# EAGLE design tablespoon (EAGLE 6.5.0)
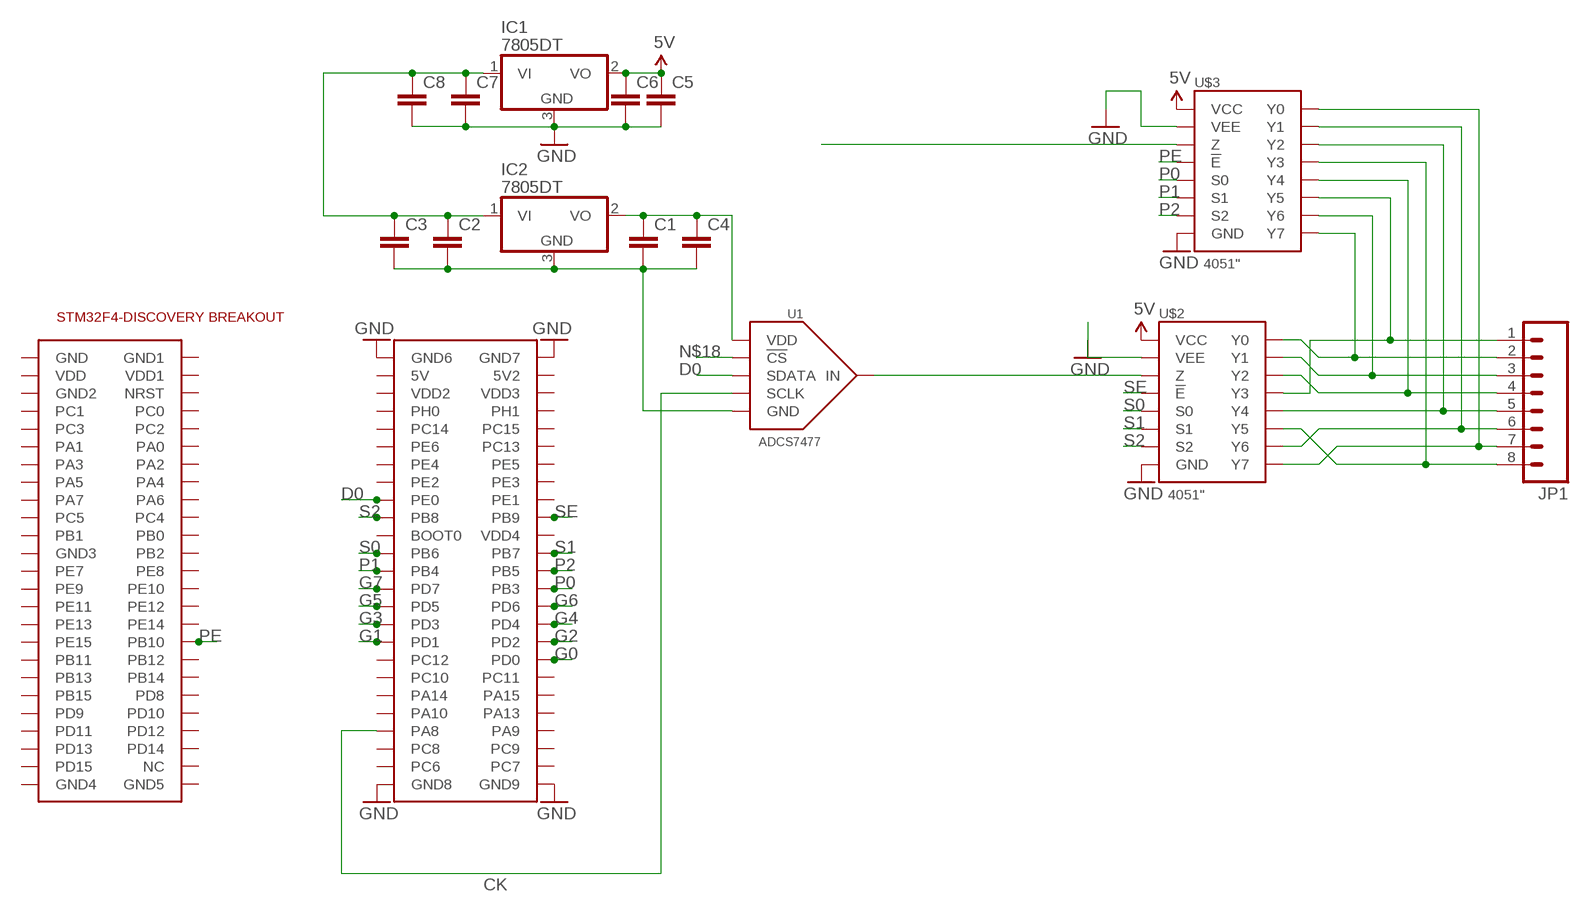
[diagram p0: schematic, sheet 1]

## Parts
C1  C-EUC0805  [C0805]
C2  C-EUC0805  [C0805]
C3  C-EUC0805  [C0805]
C4  C-EUC0805  [C0805]
C5  C-EUC0805  [C0805]
C6  C-EUC0805  [C0805]
C7  C-EUC0805  [C0805]
C8  C-EUC0805  [C0805]
IC1  7805DT  [TO252]
IC2  7805DT  [TO252]
JP1  M08LONGPADS  [1X08_LONGPADS]
U1  ADCS7477  [SOT-23-6]
U$1  STM32F4-DISCOVERY  [STM32F4-DISCOVERY]
U$2  4051"  [TSSOP-16]
U$3  4051"  [TSSOP-16]

## Nets
5V: C5.1 C6.1 IC1.2(VO) U$2.P$16(VCC) U$3.P$16(VCC)
CK: U1.P$4(SCLK) U$1.P$93(PA8)
D0: U1.P$5(SDATA) U$1.P$67(PE0)
G0: U$1.P$86(PD0)
G1: U$1.P$83(PD1)
G2: U$1.P$84(PD2)
G3: U$1.P$81(PD3)
G4: U$1.P$82(PD4)
G5: U$1.P$79(PD5)
G6: U$1.P$80(PD6)
G7: U$1.P$77(PD7)
GND: C5.2 C6.2 C7.2 C8.2 IC1.3(GND) U$1.P$51(GND6) U$1.P$52(GND7) U$1.P$99(GND8) U$1.P$100(GND9) U$2.P$7(VEE) U$2.P$8(GND) U$3.P$7(VEE) U$3.P$8(GND)
N$1: U1.P$3(IN) U$2.P$3(Z)
N$2: C1.1 C4.1 IC2.2(VO) U1.P$1(VDD)
N$3: C1.2 C2.2 C3.2 C4.2 IC2.3(GND) U1.P$2(GND)
N$5: C2.1 C3.1 C7.1 C8.1 IC1.1(VI) IC2.1(VI)
N$6: JP1.4 U$2.P$15(Y2) U$3.P$1(Y4)
N$7: JP1.7 U$2.P$4(Y7) U$3.P$13(Y0)
N$8: JP1.5 U$2.P$1(Y4) U$3.P$15(Y2)
N$9: JP1.8 U$2.P$5(Y5) U$3.P$12(Y3)
N$10: JP1.1 U$2.P$12(Y3) U$3.P$5(Y5)
N$11: JP1.2 U$2.P$13(Y0) U$3.P$4(Y7)
N$12: JP1.3 U$2.P$14(Y1) U$3.P$2(Y6)
N$13: JP1.6 U$2.P$2(Y6) U$3.P$14(Y1)
N$18: U1.P$6(!CS)
N$27: U$3.P$3(Z)
P0: U$1.P$78(PB3) U$3.P$11(S0)
P1: U$1.P$75(PB4) U$3.P$10(S1)
P2: U$1.P$76(PB5) U$3.P$9(S2)
PE: U$1.P$34(PB10) U$3.P$6(!E)
S0: U$1.P$73(PB6) U$2.P$11(S0)
S1: U$1.P$74(PB7) U$2.P$10(S1)
S2: U$1.P$69(PB8) U$2.P$9(S2)
SE: U$1.P$70(PB9) U$2.P$6(!E)
Unconnected: U$1.P$1(GND) U$1.P$2(GND1) U$1.P$3(VDD) U$1.P$4(VDD1) U$1.P$5(GND2) U$1.P$6(NRST) U$1.P$7(PC1) U$1.P$8(PC0) U$1.P$9(PC3) U$1.P$10(PC2) U$1.P$11(PA1) U$1.P$12(PA0) U$1.P$13(PA3) U$1.P$14(PA2) U$1.P$15(PA5) U$1.P$16(PA4) U$1.P$17(PA7) U$1.P$18(PA6) U$1.P$19(PC5) U$1.P$20(PC4) U$1.P$21(PB1) U$1.P$22(PB0) U$1.P$23(GND3) U$1.P$24(PB2) U$1.P$25(PE7) U$1.P$26(PE8) U$1.P$27(PE9) U$1.P$28(PE10) U$1.P$29(PE11) U$1.P$30(PE12) U$1.P$31(PE13) U$1.P$32(PE14) U$1.P$33(PE15) U$1.P$35(PB11) U$1.P$36(PB12) U$1.P$37(PB13) U$1.P$38(PB14) U$1.P$39(PB15) U$1.P$40(PD8) U$1.P$41(PD9) U$1.P$42(PD10) U$1.P$43(PD11) U$1.P$44(PD12) U$1.P$45(PD13) U$1.P$46(PD14) U$1.P$47(PD15) U$1.P$48(NC) U$1.P$49(GND4) U$1.P$50(GND5) U$1.P$53(5V) U$1.P$54(5V2) U$1.P$55(VDD2) U$1.P$56(VDD3) U$1.P$57(PH0) U$1.P$58(PH1) U$1.P$59(PC14) U$1.P$60(PC15) U$1.P$61(PE6) U$1.P$62(PC13) U$1.P$63(PE4) U$1.P$64(PE5) U$1.P$65(PE2) U$1.P$66(PE3) U$1.P$68(PE1) U$1.P$71(BOOT0) U$1.P$72(VDD4) U$1.P$85(PC12) U$1.P$87(PC10) U$1.P$88(PC11) U$1.P$89(PA14) U$1.P$90(PA15) U$1.P$91(PA10) U$1.P$92(PA13) U$1.P$94(PA9) U$1.P$95(PC8) U$1.P$96(PC9) U$1.P$97(PC6) U$1.P$98(PC7)

## Library data of the parts
C1-C8 = rcl:C-EU: CAPACITOR, European symbol
IC1 IC2 = linear:78*: Positive VOLTAGE REGULATOR Source: http://cache.national.com/ds/LM/LM78L05.pdf http://www.fairchildsemi.com/ds/LM/LM7805.pdf
JP1 = SparkFun-Connectors:M08: Header 8 Standard 8-pin 0.1" header. Use with straight break away headers (SKU : PRT-00116), right angle break away headers (PRT-00553), swiss pins (PRT-00743), machine pins (PRT-00117), and female headers (PRT-00115).
U1 = butter:ADCS7477: TI ADCS7477 10 bit 1MSPS ADC 5V 10mW Digikey <http://www.digikey.com/product-detail/en/ADCS7477AIMF%2FNOPB/ADCS7477AIMF%2FNOPBTR-ND/568478>
U$1 = STM32F4-DISCOVERY:STM32F4-DISCOVERY
U$2 U$3 = butter:4051: 74HC4051PW NXP 8:1 Analog Multiplexer digikey <http://www.digikey.com/product-detail/en/74HC4051PW,118/568-2259-1-ND/946721>

## Board
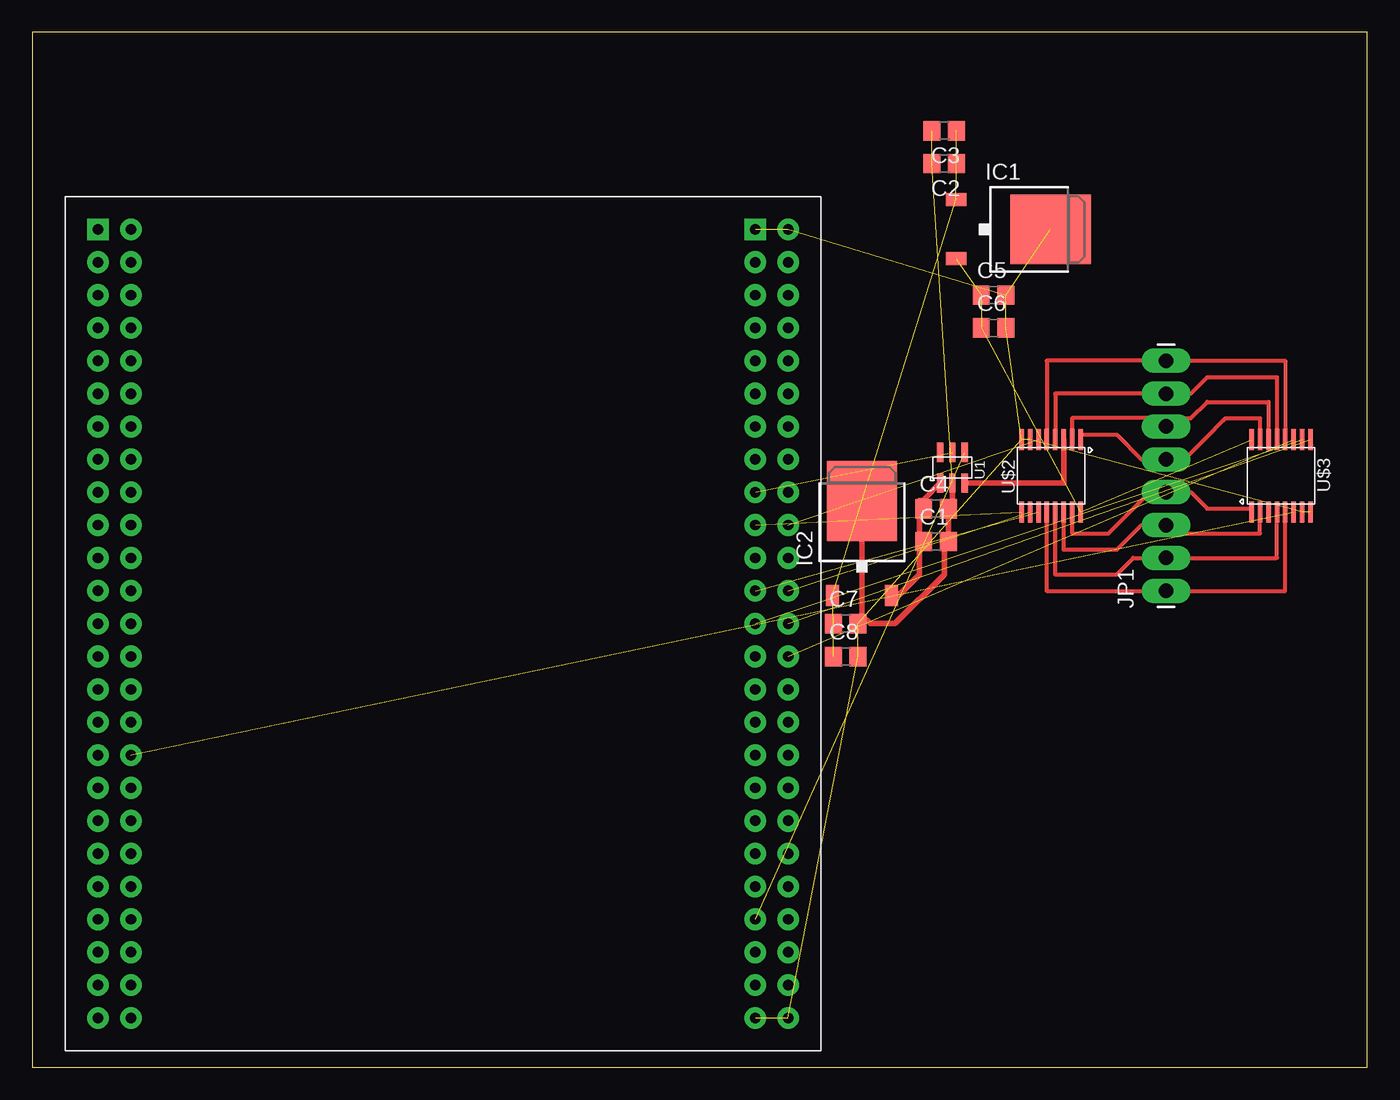
[diagram p1: board, top side]

Size 103.17 x 80 mm. Coordinates in mm from the lower left corner, seen from the top.
Outline: 0,0 103.17,0 103.17,80 0,80 0,0
Copper layers (1*16): Top 0.035mm / dielectric 1.5mm / Bottom 0.035mm
Design rules "default": minimum track width 10mil, minimum drill 24mil, track to track 8mil, track to pad 8mil, pad to pad 8mil, via to via 8mil, smd to smd 8mil, copper to edge 40mil, drill to drill 8mil, minimum pad ring 10mil, minimum via ring 8mil, stop-mask expansion 4mil, vias tented up to drill 0mil, thermal gap 10mil

### Footprints (pad centres in the part's own frame; a part is rotated, then mirrored left to right if it is on the bottom)
C0805 = smd 1.3 x 1.5: 1 -0.95,0; 2 0.95,0
TO252 = smd 1 x 1.6: 1 -2.28,-4.8; 2 2.28,-4.8 | smd 5.4 x 6.2: 3 0,2.5
1X08_LONGPADS = drill 1.118 pad 1.88 long: 1 0,0; 2 2.54,0; 3 5.08,0; 4 7.62,0; 5 10.16,0; 6 12.7,0; 7 15.24,0; 8 17.78,0
SOT-23-6 = smd 1.473 x 0.483: P$1 -1.181,0.95; P$2 -1.181,0; P$3 -1.181,-0.95; P$4 1.181,-0.95; P$5 1.181,0; P$6 1.181,0.95
STM32F4-DISCOVERY = drill 0.8 pad 1.676 square: P$1 -27.94,30.48; P$51 22.86,30.48 | drill 0.8 pad 1.676: P$2 -25.4,30.48; P$3 -27.94,27.94; P$4 -25.4,27.94; P$5 -27.94,25.4; P$6 -25.4,25.4; P$7 -27.94,22.86; P$8 -25.4,22.86; P$9 -27.94,20.32; P$10 -25.4,20.32; P$11 -27.94,17.78; P$12 -25.4,17.78; P$13 -27.94,15.24; P$14 -25.4,15.24; P$15 -27.94,12.7; P$16 -25.4,12.7; P$17 -27.94,10.16; P$18 -25.4,10.16; P$19 -27.94,7.62; P$20 -25.4,7.62; P$21 -27.94,5.08; P$22 -25.4,5.08; P$23 -27.94,2.54; P$24 -25.4,2.54; P$25 -27.94,0; P$26 -25.4,0; P$27 -27.94,-2.54; P$28 -25.4,-2.54; P$29 -27.94,-5.08; P$30 -25.4,-5.08; P$31 -27.94,-7.62; P$32 -25.4,-7.62; P$33 -27.94,-10.16; P$34 -25.4,-10.16; P$35 -27.94,-12.7; P$36 -25.4,-12.7; P$37 -27.94,-15.24; P$38 -25.4,-15.24; P$39 -27.94,-17.78; P$40 -25.4,-17.78; P$41 -27.94,-20.32; P$42 -25.4,-20.32; P$43 -27.94,-22.86; P$44 -25.4,-22.86; P$45 -27.94,-25.4; P$46 -25.4,-25.4; P$47 -27.94,-27.94; P$48 -25.4,-27.94; P$49 -27.94,-30.48; P$50 -25.4,-30.48; P$52 25.4,30.48; P$53 22.86,27.94; P$54 25.4,27.94; P$55 22.86,25.4; P$56 25.4,25.4; P$57 22.86,22.86; P$58 25.4,22.86; P$59 22.86,20.32; P$60 25.4,20.32; P$61 22.86,17.78; P$62 25.4,17.78; P$63 22.86,15.24; P$64 25.4,15.24; P$65 22.86,12.7; P$66 25.4,12.7; P$67 22.86,10.16; P$68 25.4,10.16; P$69 22.86,7.62; P$70 25.4,7.62; P$71 22.86,5.08; P$72 25.4,5.08; P$73 22.86,2.54; P$74 25.4,2.54; P$75 22.86,0; P$76 25.4,0; P$77 22.86,-2.54; P$78 25.4,-2.54; P$79 22.86,-5.08; P$80 25.4,-5.08; P$81 22.86,-7.62; P$82 25.4,-7.62; P$83 22.86,-10.16; P$84 25.4,-10.16; P$85 22.86,-12.7; P$86 25.4,-12.7; P$87 22.86,-15.24; P$88 25.4,-15.24; P$89 22.86,-17.78; P$90 25.4,-17.78; P$91 22.86,-20.32; P$92 25.4,-20.32; P$93 22.86,-22.86; P$94 25.4,-22.86; P$95 22.86,-25.4; P$96 25.4,-25.4; P$97 22.86,-27.94; P$98 25.4,-27.94; P$99 22.86,-30.48; P$100 25.4,-30.48
TSSOP-16 = smd 1.6 x 0.35: P$1 -2.8,2.275; P$2 -2.8,1.625; P$3 -2.8,0.975; P$4 -2.8,0.325; P$5 -2.8,-0.325; P$6 -2.8,-0.975; P$7 -2.8,-1.625; P$8 -2.8,-2.275; P$9 2.8,-2.275; P$10 2.8,-1.625; P$11 2.8,-0.975; P$12 2.8,-0.325; P$13 2.8,0.325; P$14 2.8,0.975; P$15 2.8,1.625; P$16 2.8,2.275

### Placement (x,y rotation side)
C1  69.85,40.64 0 top
C2  70.48,69.85 180 top
C3  70.48,72.39 180 top
C4  69.85,43.18 0 top
C5  74.3,59.69 0 top
C6  74.3,57.15 0 top
C7  62.87,34.29 0 top
C8  62.87,31.75 0 top
IC1  76.2,64.77 270 top
IC2  64.14,41.27 0 top
JP1  87.63,36.83 90 top
U1  71.12,46.35 90 top
U$1  33.02,34.29 0 top
U$2  78.74,45.72 270 top
U$3  96.52,45.72 90 top

### Tracks (layer width: path | path; a pad name or v marks a point on that pad's centre or on a via)
5V  (4 unrouted)
CK  (1 unrouted)
D0  (1 unrouted)
GND  (12 unrouted)
N$1
  Top 0.406: U1.P$3 79.72,45.17 U$2.P$3
N$2
  Top 0.406: U1.P$1 68.9,43.9 C4.1 68.9,43.81 68.58,43.81 68.58,40.64 C1.1 68.58,40.32 68.58,38.1 66.95,36.48 IC2.2
N$3  (2 unrouted)
  Top 0.406: U1.P$2 71.12,43.18 C4.2 C1.2 70.48,40.33 70.48,38.1 66.67,34.29 64.77,34.29 64.14,34.92 IC2.3
N$5  (5 unrouted)
N$6
  Top 0.305: U$2.P$15 80.36,41.27 83.19,41.27 86.36,44.45 JP1.4 89.53,44.45 90.81,43.18 94.25,43.18 U$3.P$1
N$7
  Top 0.305: U$2.P$4 79.06,52.07 JP1.7 89.53,52.07 90.81,53.34 96.19,53.34 U$3.P$13
N$8
  Top 0.305: U$2.P$1 81.02,48.9 83.82,48.9 85.72,46.99 JP1.5 89.05,46.99 90.81,48.74 92.08,50.02 92.22,50.16 94.89,50.16 U$3.P$15
N$9
  Top 0.305: U$2.P$5 78.42,54.61 JP1.8 96.84,54.61 U$3.P$12
N$10
  Top 0.305: U$2.P$12 78.42,36.83 JP1.1 96.84,36.83 U$3.P$5
N$11
  Top 0.305: U$2.P$13 79.06,38.1 83.82,38.1 85.09,39.37 JP1.2 96.19,39.37 U$3.P$4
N$12
  Top 0.305: U$2.P$14 79.72,40.01 83.82,40.01 85.72,41.91 JP1.3 88.9,41.91 88.9,41.27 94.89,41.27 U$3.P$2
N$13
  Top 0.305: 87.63,50.16 80.36,50.16 U$2.P$2 | JP1.6 87.63,50.16 | 87.63,50.16 89.53,50.16 90.81,51.44 95.55,51.44 U$3.P$14
P0  (1 unrouted)
P1  (1 unrouted)
P2  (1 unrouted)
PE  (1 unrouted)
S0  (1 unrouted)
S1  (1 unrouted)
S2  (1 unrouted)
SE  (1 unrouted)